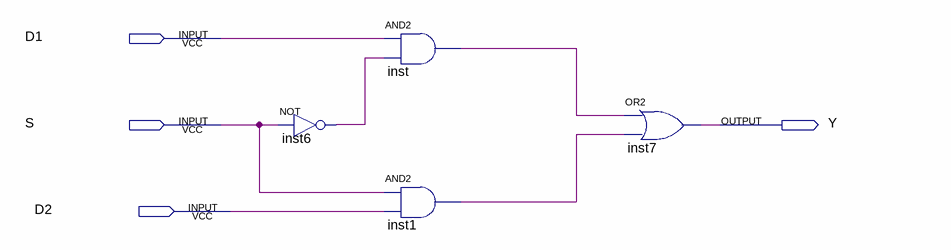
[diagram p0: schematic sheet]
// Quartus schematic mux2.bdf as structural Verilog: 4 symbols, 4 pins
module mux2 (
  input  D1,
  input  S,
  input  D2,
  output Y
);

  wire inst1_out, inst6_out, inst_out;

  not inst6 (inst6_out, S);
  and inst (inst_out, D1, inst6_out);
  and inst1 (inst1_out, S, D2);
  or inst7 (Y, inst_out, inst1_out);
endmodule
